# EAGLE design ezrpi (EAGLE 8.0.2)
CNAME: EZRPi sub-GHz Raspberry Pi HAT; CREVISION: 1.0; DESIGNER: Christophe VG
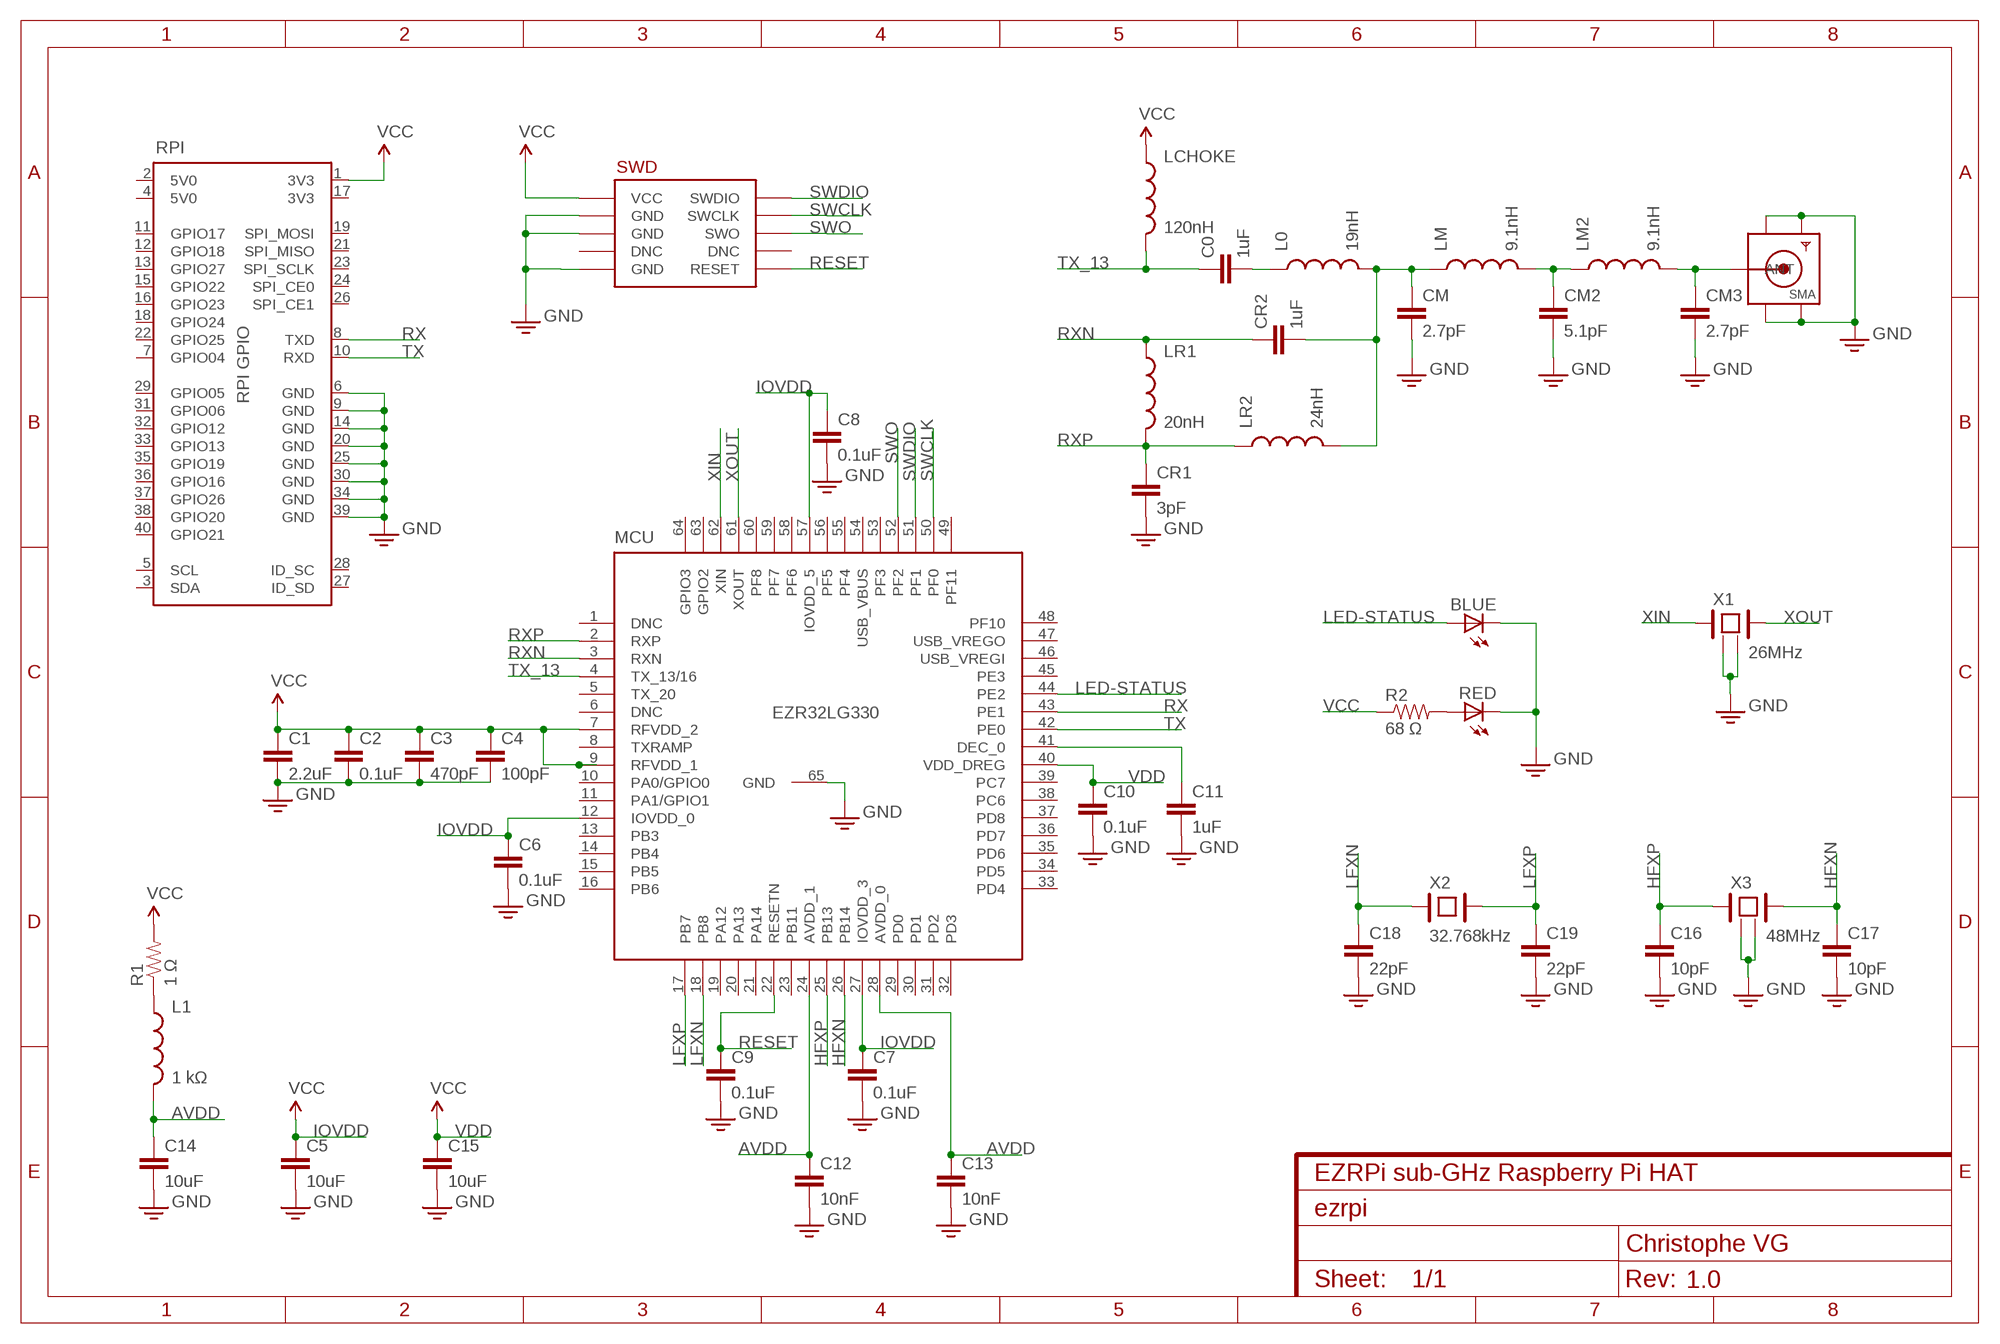
[diagram p0: schematic, sheet 1]

## Parts
BLUE  LEDCHIPLED_0805  [CHIPLED_0805]
C0  1uF  CAP0805  [0805]
C1  2.2uF  CAP0805  [0805]
C2  0.1uF  CAP0805  [0805]
C3  470pF  CAP0805  [0805]
C4  100pF  CAP0805  [0805]
C5  10uF  CAP0805  [0805]
C6  0.1uF  CAP0805  [0805]
C7  0.1uF  CAP0805  [0805]
C8  0.1uF  CAP0805  [0805]
C9  0.1uF  CAP0805  [0805]
C10  0.1uF  CAP0805  [0805]
C11  1uF  CAP0805  [0805]
C12  10nF  CAP0805  [0805]
C13  10nF  CAP0805  [0805]
C14  10uF  CAP0805  [0805]
C15  10uF  CAP0805  [0805]
C16  10pF  CAP0805  [0805]
C17  10pF  CAP0805  [0805]
C18  22pF  CAP0805  [0805]
C19  22pF  CAP0805  [0805]
CM  2.7pF  CAP0805  [0805]
CM2  5.1pF  CAP0805  [0805]
CM3  2.7pF  CAP0805  [0805]
CR1  3pF  CAP0805  [0805]
CR2  1uF  CAP0805  [0805]
L0  19nH  INDUCTOR0402  [C0402]
L1  1 kΩ  INDUCTOR0805  [0805]
LCHOKE  120nH  INDUCTOR0805  [0805]
LM  9.1nH  INDUCTOR0805  [0805]
LM2  9.1nH  INDUCTOR0805  [0805]
LR1  20nH  INDUCTOR0805  [0805]
LR2  24nH  INDUCTOR0805  [0805]
MCU  EZR32LG330  [QFN64G-0.5-9X9MM]
R1  1 Ω  RESISTOR0805-RES  [0805]
R2  68 Ω  RESISTOR0805-RES  [0805]
RED  LEDCHIPLED_0805  [CHIPLED_0805]
RPI  RPI3_HAT  [RASPI_BOARD_B+HAT_DF_CF]
SMA  SMACONNECTOR  [SMA90_DIP]
SWD  FTSH2X5  [HEADER2X5]
X1  26MHz  ABM8  [ABM8]
X2  32.768kHz  MS3V-T1R  [MS3V-T1R]
X3  48MHz  ABM11  [ABM11]

## Nets
AVDD: C12.1 C13.1 C14.1 L1.2 MCU.24(AVDD_1) MCU.28(AVDD_0)
GND: BLUE.C C1.2 C2.2 C3.2 C4.2 C5.2 C6.2 C7.2 C8.2 C9.2 C10.2 C11.2 C12.2 C13.2 C14.2 C15.2 C16.2 C17.2 C18.2 C19.2 CM2.2 CM3.2 CM.2 CR1.2 MCU.65(GND) RED.C RPI.6(GND) RPI.9(GND) RPI.14(GND) RPI.20(GND) RPI.25(GND) RPI.30(GND) RPI.34(GND) RPI.39(GND) SMA.GND1 SMA.GND2 SMA.GND3 SMA.GND4 SWD.P$3(GND) SWD.P$5(GND) SWD.P$9(GND) X1.2(GND) X1.4(GND) X3.2(GND) X3.4(GND)
HFXN: C17.1 MCU.26(PB14) X3.3
HFXP: C16.1 MCU.25(PB13) X3.1
IOVDD: C5.1 C6.1 C7.1 C8.1 MCU.12(IOVDD_0) MCU.27(IOVDD_3) MCU.57(IOVDD_5) ; supply symbol labelled VCC
LED-STATUS: BLUE.A MCU.44(PE2)
LFXN: C18.1 MCU.18(PB8) X2.1
LFXP: C19.1 MCU.17(PB7) X2.2
N$1: CM3.1 LM2.2 SMA.ANTENNA(ANT)
N$2: C11.1 MCU.41(DEC_0)
N$3: CM2.1 LM2.1 LM.2
N$4: L1.1 R1.1
N$6: C0.2 L0.1
N$7: CM.1 CR2.2 L0.2 LM.1 LR2.2
N$8: R2.2 RED.A
RESET: C9.1 MCU.22(RESETN) SWD.P$10(RESET)
RX: MCU.43(PE1) RPI.8(TXD)
RXN: CR2.1 LR1.1 MCU.3(RXN)
RXP: CR1.1 LR1.2 LR2.1 MCU.2(RXP)
SWCLK: MCU.50(PF0) SWD.P$4(SWCLK)
SWDIO: MCU.51(PF1) SWD.P$2(SWDIO)
SWO: MCU.52(PF2) SWD.P$6(SWO)
TX: MCU.42(PE0) RPI.10(RXD)
TX_13: C0.1 LCHOKE.2 MCU.4(TX_13/16)
VCC: C1.1 C2.1 C3.1 C4.1 LCHOKE.1 MCU.7(RFVDD_2) MCU.9(RFVDD_1) R1.2 R2.1 RPI.1(3V3) SWD.P$1(VCC)
VDD: C10.1 C15.1 MCU.40(VDD_DREG) ; supply symbol labelled VCC
XIN: MCU.62(XIN) X1.1
XOUT: MCU.61(XOUT) X1.3
Unconnected: MCU.1(DNC) MCU.5(TX_20) MCU.6(DNC) MCU.8(TXRAMP) MCU.10(PA0/GPIO0) MCU.11(PA1/GPIO1) MCU.13(PB3) MCU.14(PB4) MCU.15(PB5) MCU.16(PB6) MCU.19(PA12) MCU.20(PA13) MCU.21(PA14) MCU.23(PB11) MCU.29(PD0) MCU.30(PD1) MCU.31(PD2) MCU.32(PD3) MCU.33(PD4) MCU.34(PD5) MCU.35(PD6) MCU.36(PD7) MCU.37(PD8) MCU.38(PC6) MCU.39(PC7) MCU.45(PE3) MCU.46(USB_VREGI) MCU.47(USB_VREGO) MCU.48(PF10) MCU.49(PF11) MCU.53(PF3) MCU.54(USB_VBUS) MCU.55(PF4) MCU.56(PF5) MCU.58(PF6) MCU.59(PF7) MCU.60(PF8) MCU.63(GPIO2) MCU.64(GPIO3) RPI.3(SDA) RPI.5(SCL) RPI.7(GPIO04) RPI.11(GPIO17) RPI.12(GPIO18) RPI.13(GPIO27) RPI.15(GPIO22) RPI.16(GPIO23) RPI.18(GPIO24) RPI.19(SPI_MOSI) RPI.21(SPI_MISO) RPI.22(GPIO25) RPI.23(SPI_SCLK) RPI.24(SPI_CE0) RPI.26(SPI_CE1) RPI.27(ID_SD) RPI.28(ID_SC) RPI.29(GPIO05) RPI.31(GPIO06) RPI.32(GPIO12) RPI.33(GPIO13) RPI.35(GPIO19) RPI.36(GPIO16) RPI.37(GPIO26) RPI.38(GPIO20) RPI.40(GPIO21) SWD.P$7(DNC) SWD.P$8(DNC)

## Power pins joined to a net without a drawn wire
3V3: RPI.17(3V3)
5V0: RPI.2(5V0) RPI.4(5V0)

## Library data of the parts
BLUE RED = led:LED: LED OSRAM: - CHIPLED LG R971, LG N971, LY N971, LG Q971, LY Q971, LO R971, LY R971 LH N974, LH R974 LS Q976, LO Q976, LY Q976 LO Q996 - Hyper CHIPLED LW Q18S LB Q993, LB Q99A, LB R99A - SideLED LS A670, LO A670, LY A670, LG A670, LP A670 LB A673, LV A673, LT A673, LW A673 LH A674 LY A675 LS A676, LA A676, LO A676, LY A676, LW A676 LS A679, LY A679, LG A679 - Hyper Micro SIDELED® LS Y876, LA Y876, LO Y876, LY Y876 LT Y87S - SmartLED LW L88C, LW L88S LB L89C, LB L89S, LG L890 LS L89K, LO L89K, LY L89K LS L896, LA L896, LO L896, LY L896 - TOPLED LS T670, LO T670, LY T670, LG T670, LP T670 LSG T670, LSP T670, LSY T670, LOP T670, LYG T670 LG T671, LOG T671, LSG T671 LB T673, LV T673, LT T673, LW T673 LH T674 LS T676, LA T676, LO T676, LY T676, LB T676, LH T676, LSB T676, LW T676 LB T67C, LV T67C, LT T67C, LS T67K, LO T67K, LY T67K, LW E67C LS E67B, LA E67B, LO E67B, LY E67B, LB E67C, LV E67C, LT E67C LW T67C LS T679, LY T679, LG T679 LS T770, LO T770, LY T770, LG T770, LP T770 LB T773, LV T773, LT T773, LW T773 LH T774 LS E675, LA E675, LY E675, LS T675 LS T776, LA T776, LO T776, LY T776, LB T776 LHGB T686 LT T68C, LB T68C - Hyper Mini TOPLED® LB M676 - Mini TOPLED Santana® LG M470 LS M47K, LO M47K, LY M47K Source: http://www.osram.convergy.de LUXEON: - LUMILED® LXK2-PW12-R00, LXK2-PW12-S00, LXK2-PW14-U00, LXK2-PW14-V00 LXK2-PM12-R00, LXK2-PM12-S00, LXK2-PM14-U00 LXK2-PE12-Q00, LXK2-PE12-R00, LXK2-PE12-S00, LXK2-PE14-T00, LXK2-PE14-U00 LXK2-PB12-K00, LXK2-PB12-L00, LXK2-PB12-M00, LXK2-PB14-N00, LXK2-PB14-P00, LXK2-PB14-Q00 LXK2-PR12-L00, LXK2-PR12-M00, LXK2-PR14-Q00, LXK2-PR14-R00 LXK2-PD12-Q00, LXK2-PD12-R00, LXK2-PD12-S00 LXK2-PH12-R00, LXK2-PH12-S00 LXK2-PL12-P00, LXK2-PL12-Q00, LXK2-PL12-R00 Source: www.luxeon.com KINGBRIGHT: KA-3528ASYC Source: www.kingbright.com
C0 C1-C19 CM CM2 CM3 CR1 CR2 = passive:CAP: Capacitor Standard 0603 ceramic capacitor, and 0.1" leaded capacitor.
L0 L1 LCHOKE LM LM2 LR1 LR2 = passive:INDUCTOR: Inductors Basic Inductor/Choke - 0603 and 1206. Footprints are not proven and vary greatly between part numbers. INDUCTOR POWER 3.3UH 4.0A SMD 0.197" L x 0.197" W x 0.177" H (5.00mm x 5.00mm x 4.50mm)
MCU = ezr:EZR32LG330
R1 R2 = passive:RESISTOR: Resistor Basic schematic elements and footprints for 0603, 1206, and PTH resistors.
RPI = rpi:RPI3_HAT
SMA = connector:SMACONNECTOR: SMA Connector 90° DIP SMA Connector, 50 Ohm (4UConnector: 07259)
SWD = connector:FTSH2X5
X1 = xtal:ABM8
X2 = xtal:MS3V-T1R
X3 = xtal:ABM11

## Board
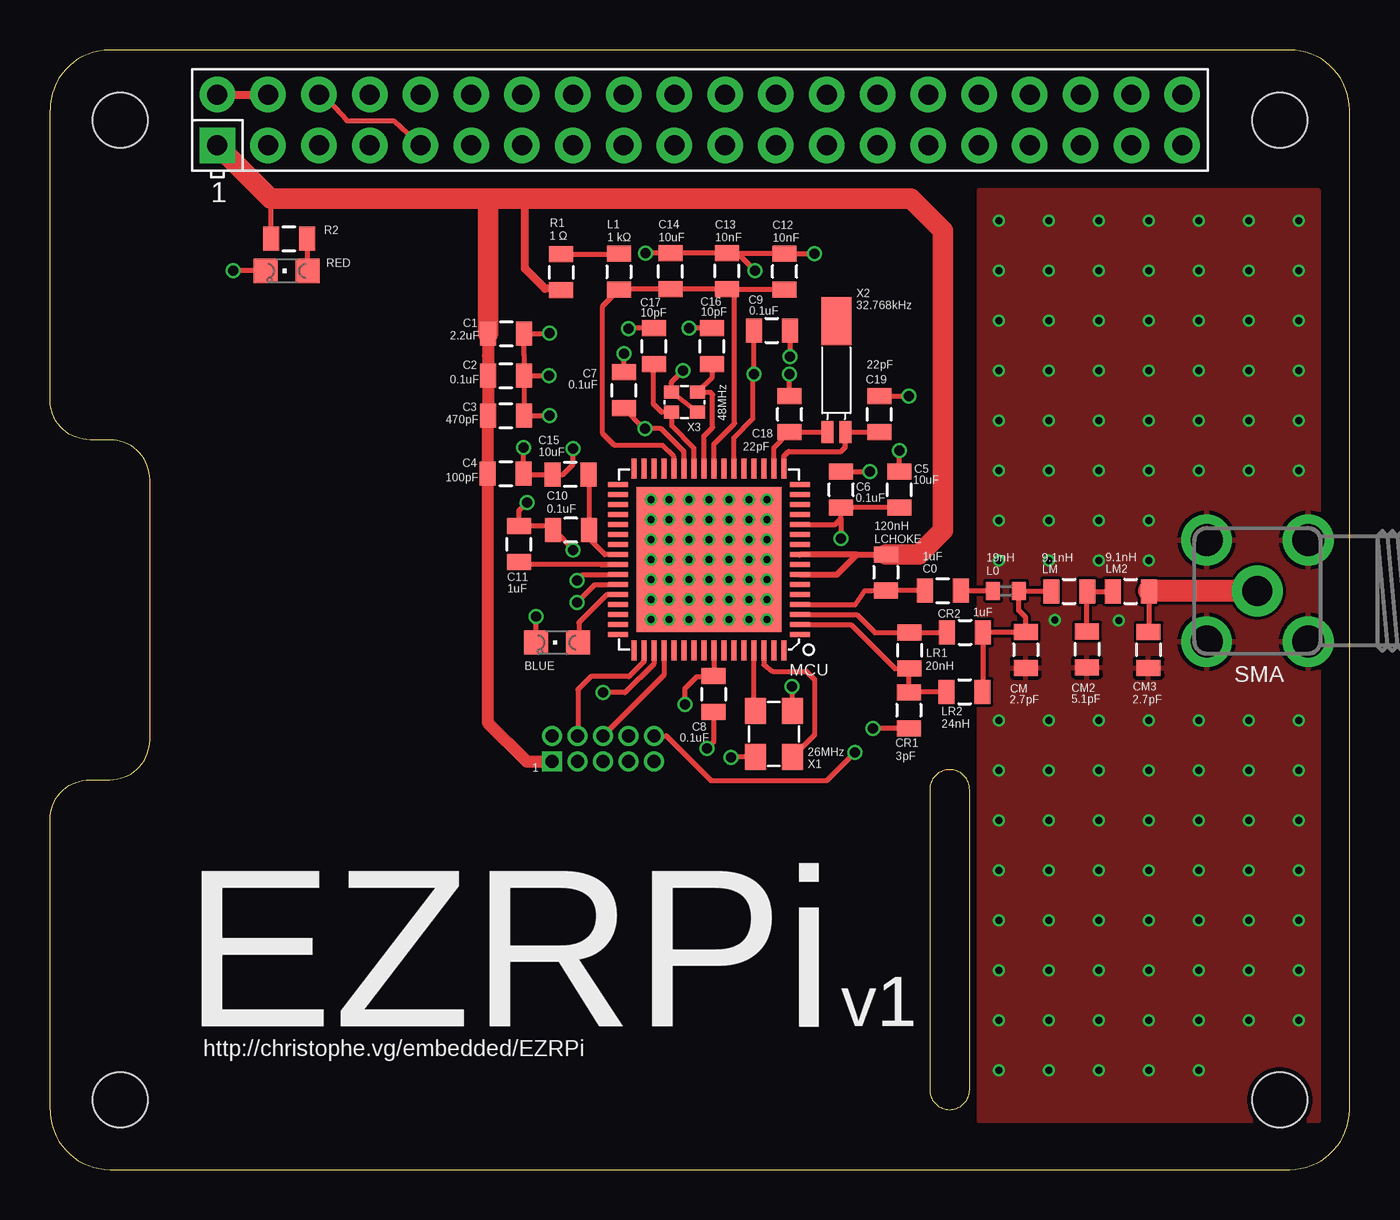
[diagram p1: board, top side]
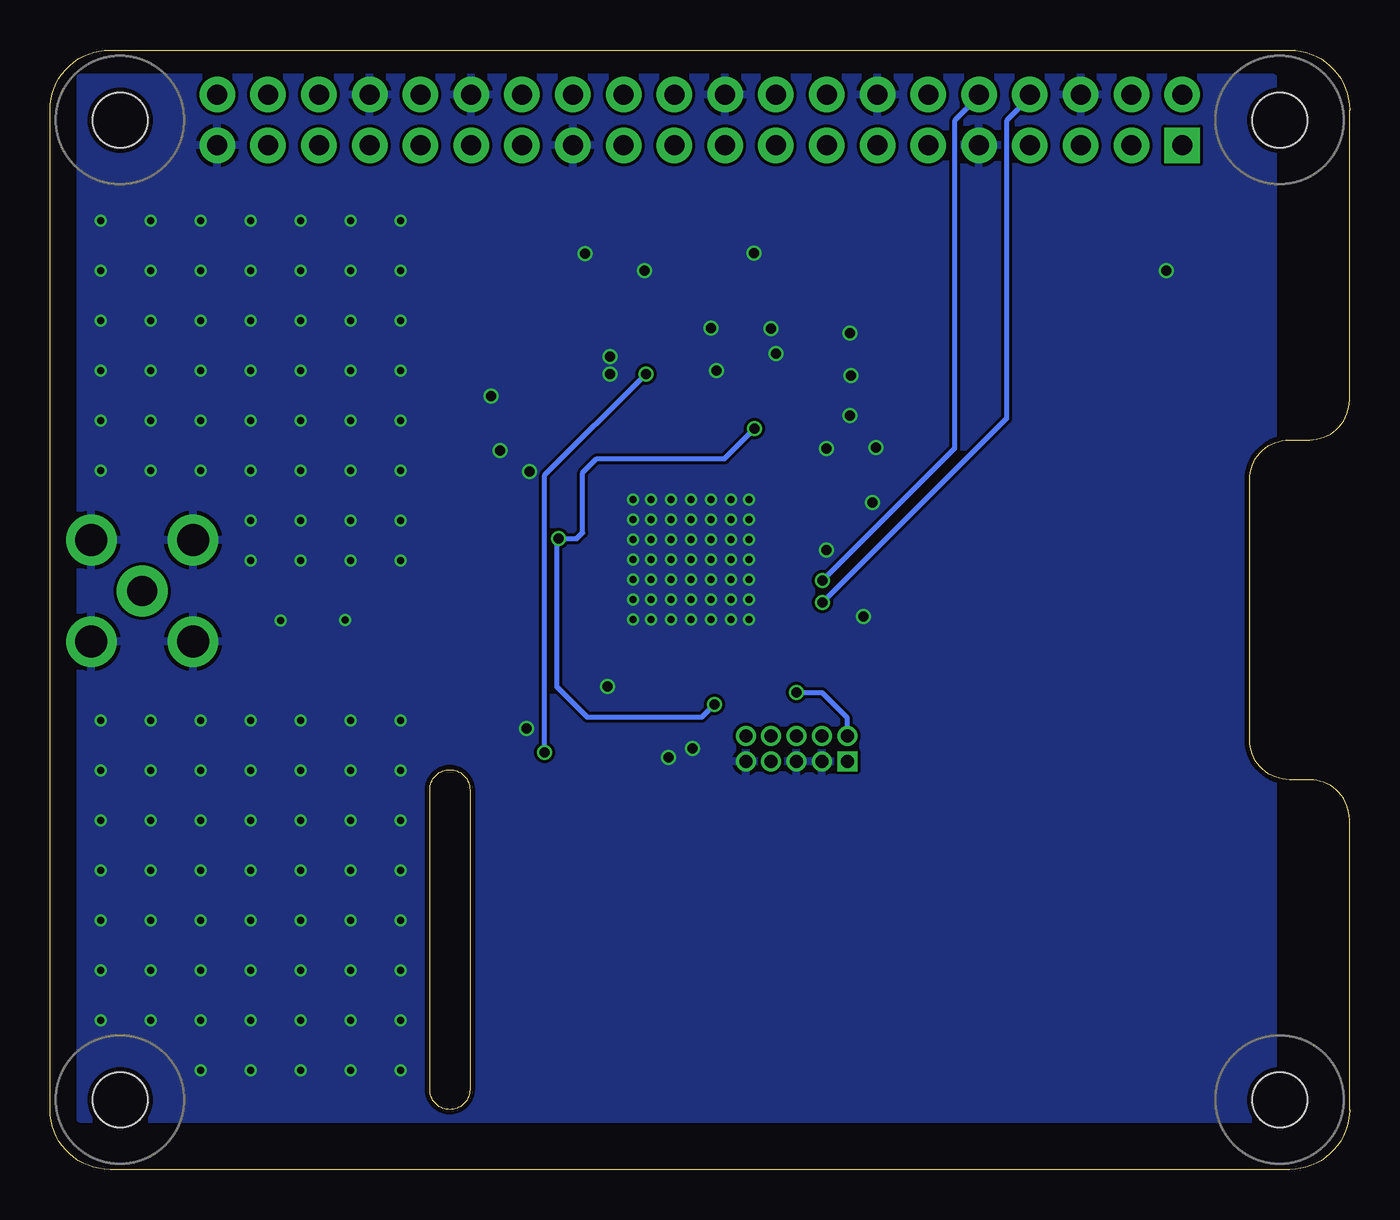
[diagram p2: board, bottom side, seen from below]

Size 65 x 56 mm. Coordinates in mm from the lower left corner, seen from the top.
Copper layers (1*16): Top 0.018mm / dielectric 1.55mm / Bottom 0.018mm
Design rules "eC_2Layer_PClass6_BaseCopperO18_eCDefault *": minimum track width 0.15mm, minimum drill 0.35mm, track to track 0.15mm, track to pad 0.15mm, pad to pad 0.15mm, via to via 0.15mm, smd to smd 0mil, copper to edge 0.25mm, drill to drill 0.35mm, minimum pad ring 0.175mm, minimum via ring 0.125mm, stop-mask expansion 0mil, vias tented up to drill 0.45mm, thermal gap 0.2mm

### Footprints (pad centres in the part's own frame; a part is rotated, then mirrored left to right if it is on the bottom)
CHIPLED_0805 = smd 1.2 x 1.2: A 0,-1.05; C 0,1.05
0805 = smd 0.8 x 1.2: 1 -0.9,0; 2 0.9,0
C0402 = smd 0.7 x 0.9: 1 -0.65,0; 2 0.65,0
QFN64G-0.5-9X9MM = smd 1 x 0.25: 1 -4.55,3.75; 2 -4.55,3.25; 3 -4.55,2.75; 4 -4.55,2.25; 5 -4.55,1.75; 6 -4.55,1.25; 7 -4.55,0.75; 8 -4.55,0.25; 9 -4.55,-0.25; 10 -4.55,-0.75; 11 -4.55,-1.25; 12 -4.55,-1.75; 13 -4.55,-2.25; 14 -4.55,-2.75; 15 -4.55,-3.25; 16 -4.55,-3.75; 33 4.55,-3.75; 34 4.55,-3.25; 35 4.55,-2.75; 36 4.55,-2.25; 37 4.55,-1.75; 38 4.55,-1.25; 39 4.55,-0.75; 40 4.55,-0.25; 41 4.55,0.25; 42 4.55,0.75; 43 4.55,1.25; 44 4.55,1.75; 45 4.55,2.25; 46 4.55,2.75; 47 4.55,3.25; 48 4.55,3.75 | smd 0.25 x 1: 17 -3.75,-4.55; 18 -3.25,-4.55; 19 -2.75,-4.55; 20 -2.25,-4.55; 21 -1.75,-4.55; 22 -1.25,-4.55; 23 -0.75,-4.55; 24 -0.25,-4.55; 25 0.25,-4.55; 26 0.75,-4.55; 27 1.25,-4.55; 28 1.75,-4.55; 29 2.25,-4.55; 30 2.75,-4.55; 31 3.25,-4.55; 32 3.75,-4.55; 49 3.75,4.55; 50 3.25,4.55; 51 2.75,4.55; 52 2.25,4.55; 53 1.75,4.55; 54 1.25,4.55; 55 0.75,4.55; 56 0.25,4.55; 57 -0.25,4.55; 58 -0.75,4.55; 59 -1.25,4.55; 60 -1.75,4.55; 61 -2.25,4.55; 62 -2.75,4.55; 63 -3.25,4.55; 64 -3.75,4.55 | smd 7.25 x 7.25: 65 0,0
RASPI_BOARD_B+HAT_DF_CF = drill 1 pad 1.778 square: 1 8.37,51.23 | drill 1 pad 1.778: 2 8.37,53.77; 3 10.91,51.23; 4 10.91,53.77; 5 13.45,51.23; 6 13.45,53.77; 7 15.99,51.23; 8 15.99,53.77; 9 18.53,51.23; 10 18.53,53.77; 11 21.07,51.23; 12 21.07,53.77; 13 23.61,51.23; 14 23.61,53.77; 15 26.15,51.23; 16 26.15,53.77; 17 28.69,51.23; 18 28.69,53.77; 19 31.23,51.23; 20 31.23,53.77; 21 33.77,51.23; 22 33.77,53.77; 23 36.31,51.23; 24 36.31,53.77; 25 38.85,51.23; 26 38.85,53.77; 27 41.39,51.23; 28 41.39,53.77; 29 43.93,51.23; 30 43.93,53.77; 31 46.47,51.23; 32 46.47,53.77; 33 49.01,51.23; 34 49.01,53.77; 35 51.55,51.23; 36 51.55,53.77; 37 54.09,51.23; 38 54.09,53.77; 39 56.63,51.23; 40 56.63,53.77 | hole 2.75: 3.5,3.5; 3.5,52.5; 61.5,3.5; 61.5,52.5
SMA90_DIP = drill 1.5 pad 2.54: ANTENNA 0,0 | drill 1.6 pad 2.54: GND1 -2.54,2.54; GND2 2.54,2.54; GND3 -2.54,-2.54; GND4 2.54,-2.54
HEADER2X5 = drill 0.65 square: P$1 -2.54,-0.635 | drill 0.65: P$2 -2.54,0.635; P$3 -1.27,-0.635; P$4 -1.27,0.635; P$5 0,-0.635; P$6 0,0.635; P$7 1.27,-0.635; P$8 1.27,0.635; P$9 2.54,-0.635; P$10 2.54,0.635
ABM8 = smd 1.3 x 1.05: 1 1.15,0.925; 2 1.15,-0.925; 3 -1.15,-0.925; 4 -1.15,0.925
MS3V-T1R = smd 2.4 x 1.5: 0 -3.1,0 | smd 1.1 x 0.6: 1 2.45,-0.45; 2 2.45,0.45
ABM11 = smd 0.75 x 0.65: 1 -0.65,-0.5; 2 0.65,-0.5; 3 0.65,0.5; 4 -0.65,0.5

### Placement (x,y rotation side)
BLUE  25.36,26.36 90 top
C0  44.66,28.96 0 top
C1  22.82,41.81 0 top
C2  22.81,39.71 0 top
C3  22.8,37.71 0 top
C4  22.79,34.81 0 top
C5  42.48,34.01 90 top
C6  39.57,34.01 90 top
C7  28.7,38.98 90 top
C8  33.19,23.78 270 top
C9  36.1,41.97 0 top
C10  26.06,31.98 180 top
C11  23.46,31.28 90 top
C12  36.74,44.92 90 top
C13  33.86,44.94 90 top
C14  31.03,44.93 90 top
C15  26.03,34.77 180 top
C16  33.11,41.18 90 top
C17  30.2,41.18 90 top
C18  36.99,37.78 90 top
C19  41.48,37.78 90 top
CM  48.8,25.99 270 top
CM2  51.87,26.02 270 top
CM3  54.94,25.99 270 top
CR1  42.96,22.97 270 top
CR2  45.77,26.87 0 top
L0  47.82,28.94 0 top
L1  28.46,44.91 270 top
LCHOKE  41.8,29.87 270 top
LM  50.98,28.92 0 top
LM2  54.05,28.92 0 top
LR1  42.99,25.97 270 top
LR2  45.74,23.89 0 top
MCU  32.95,30.51 180 top
R1  25.57,44.88 270 top
R2  11.96,46.56 0 top
RED  11.84,44.95 90 top
RPI  0,0 0 top
SMA  60.39,28.94 270 top
SWD  27.66,21.06 0 top
X1  36.2,21.78 270 top
X2  39.33,39.33 270 top
X3  31.74,38.38 180 top

### Tracks (layer width: path | path; a pad name or v marks a point on that pad's centre or on a via)
5V0
  Top 0.406: RPI.2 RPI.4
AVDD
  Top 0.254: MCU.24 33.2,36.28 34.24,37.32 34.24,43.66 C13.1 | C12.1 33.88,44.02 C13.1 | C13.1 C14.1 28.48,44.03 L1.2 | 28.44,43.99 L1.2 | MCU.28 31.2,35.66 30.64,36.22 28.24,36.22 27.64,36.82 27.64,43.19 L1.2
GND  (via drill 0.35, 0.35 pad 0.35, 0.5, 0.5 pad 0.25)
  Top 0.254: 35.27,21.08 X1.2 34.08,20.63 v34.06,20.61 | CR1.2 v41.16,22.06 | C13.2 C14.2 v29.79,45.83 | C13.2 36.72,45.84 C12.2 v38.24,45.82 | 30.16,42.12 C17.2 | 30.18,42.06 C17.2 | 23.77,34.73 C4.2 | C3.2 | C2.2 23.72,40.72 C1.2 24.5,41.81 v24.98,41.83 | C2.2 C3.2 | C3.2 v24.99,37.71 | 51.9,25.09 CM2.2 | 48.83,25.12 CM.2 | C4.2 23.73,34.77 C15.2 25.67,34.77 26.16,35.26 26.16,35.86 v26.16,36.06 | X3.4 X3.2 31.09,39.39 v31.66,39.96 | RPI.6 13.65,53.77 14.86,52.46 17.2,52.46 RPI.9 | RED.C v9.17,44.95 v9.16,44.96 | BLUE.C v24.31,27.66 | C18.2 36.99,39.73 v36.99,39.79 | C9.2 37,40.8 v37,40.66 | C7.2 v28.7,40.82 | C17.2 v28.95,42.08 v28.94,42.07 | C16.2 v31.95,42.08 | C2.2 v24.95,39.71 | C13.2 34.38,45.84 v35.26,44.96 | C19.2 v42.95,38.68 | C5.2 42.48,35.84 v42.48,35.95 | C6.2 v41.02,34.91 | C4.2 v23.69,36.12 | v23.86,33.36 23.46,32.96 C11.2 24.96,32.18 C10.2 25.24,31.98 v26.16,31 | C8.2 33.19,21.39 v32.86,21.06 | X1.4 v37.12,24.16 v37.12,24.17
  other vias: 32.95,32.52 32.95,28.52 34.95,32.52 34.95,30.52 34.95,28.52 30.95,28.52 30.95,30.52 30.95,32.52 32.95,30.51 49.96,47.46 54.96,47.46 59.96,47.46 59.96,42.46 54.96,42.46 49.96,42.46 49.96,37.46 54.96,37.46 59.96,37.46 54.96,32.46 49.96,32.46 49.96,22.46 54.96,22.46 59.96,22.46 59.96,17.46 59.96,12.46 59.96,7.46 54.96,7.46 49.96,7.46 49.96,12.46 54.96,12.46 54.96,17.46 49.96,17.46 30.95,33.52 30.05,33.52 30.05,32.52 31.95,32.52 31.95,33.52 32.95,33.52 33.95,33.52 33.95,32.52 34.95,33.52 35.85,33.52 30.05,31.52 30.05,30.52 30.95,31.52 31.95,30.51 33.95,30.52 33.95,31.52 32.95,31.52 31.95,31.52 34.95,31.52 35.85,31.52 35.85,30.52 30.05,29.52 30.05,28.52 30.05,27.52 30.95,29.52 32.95,29.52 33.95,29.52 34.95,29.52 35.85,29.52 33.95,28.52 35.85,28.52 35.85,27.52 34.95,27.52 33.95,27.52 32.95,27.52 31.95,27.52 30.95,27.52 31.95,28.52 31.95,29.52 35.85,32.52 52.46,47.46 52.46,44.96 49.96,44.96 52.46,42.46 52.46,39.96 52.46,37.46 52.46,34.96 52.46,32.46 49.96,34.96 49.96,39.96 54.96,44.96 54.96,39.96 54.96,34.96 57.46,34.96 57.46,37.46 57.46,39.96 57.46,42.46 57.46,44.96 57.46,47.46 59.96,44.96 59.96,39.96 62.46,39.96 62.46,42.46 62.46,44.96 62.46,47.46 62.46,37.46 62.46,34.96 59.96,34.96 49.96,19.96 49.96,14.96 49.96,9.96 49.96,4.96 52.46,4.96 52.46,7.46 52.46,9.96 52.46,12.46 52.46,14.96 52.46,17.46 52.46,19.96 52.46,22.46 57.46,22.46 57.46,19.96 54.96,19.96 57.46,17.46 54.96,14.96 57.46,14.96 57.46,12.46 59.96,14.96 59.96,19.96 62.46,19.96 62.46,22.46 62.46,17.46 62.46,14.96 62.46,12.46 54.96,9.96 54.96,4.96 57.46,4.96 57.46,7.46 57.46,9.96 59.96,9.96 62.46,9.96 62.46,7.46 47.46,47.46 47.46,44.96 47.46,42.46 47.46,39.96 47.46,37.46 47.46,34.96 47.46,32.46 47.46,22.46 47.46,19.96 47.46,17.46 47.46,14.96 47.46,12.46 47.46,9.96 47.46,7.46 47.46,4.96 54.96,30.46 52.46,30.46 49.96,30.46 47.46,30.46 50.25,27.48 53.46,27.46
  pour Bottom: 3.81,54.61 63.5,54.61 63.5,2.54 3.81,2.54
  pour Top: 63.46,48.96 46.46,48.96 46.46,2.46 63.46,2.46
HFXN
  Top 0.254: 30.34,40.14 C17.1 30.19,38.28 30.59,37.88 X3.3 31.1,37.2 32.2,36.1 MCU.26
HFXP
  Top 0.254: MCU.25 32.7,36.68 33.14,37.12 33.14,38.76 33.02,38.88 X3.1 33.11,39.6 C16.1
IOVDD  (via drill 0.5)
  Top 0.254: C5.1 C6.1 39.56,32.56 | 39.56,32.56 39.56,32.26 v39.56,31.56 | v31.76,23.26 31.76,24.06 32.36,24.66 33.17,24.66 C8.1 MCU.57 | MCU.12 39.26,32.26 39.56,32.56 | C7.1 29.72,37.06 v29.76,37.06 30.56,37.06 31.7,35.92 MCU.27
  Bottom 0.254: v31.76,23.26 32.39,22.63 38.13,22.63 39.66,24.16 39.66,31.46 v39.56,31.56 38.66,31.56 38.36,31.86 38.36,34.86 37.66,35.56 31.26,35.56 v29.76,37.06
LED-STATUS
  Top 0.254: MCU.44 27.86,28.76 26.46,27.36 26.46,26.41 BLUE.A
LFXN
  Top 0.254: X2.1 C18.1 36.2,36.09 MCU.18
LFXP
  Top 0.254: C19.1 X2.2 39.78,36.13 39.57,35.92 36.94,35.92 36.7,35.68 MCU.17
N$1
  Top 0.254: 54.97,28.94 LM2.2 54.95,26.91 CM3.1
  Top 1.1: SMA.ANTENNA 54.97,28.94
N$2
  Top 0.254: 27.56,30.26 MCU.41 23.58,30.26 C11.1 23.48,30.36
N$3
  Top 0.254: LM2.1 LM.2 CM2.1
N$4
  Top 0.254: R1.1 28.43,45.78 L1.1
N$6
  Top 0.254: C0.2 47.15,28.96 L0.1
N$7
  Top 0.254: LM.1 50.06,28.94 L0.2 48.46,27.96 48.8,27.62 CM.1 48.78,26.87 CR2.2 46.67,23.92 LR2.2
N$8
  Top 0.254: R2.2 12.86,44.98 RED.A
RESET  (via drill 0.5)
  Top 0.254: v40.26,20.86 38.86,19.46 33.06,19.46 30.83,21.7 SWD.P$10 | C9.1 v35.2,39.79 35.16,39.75 35.16,37.56 34.2,36.6 MCU.22
  Bottom 0.254: v40.26,20.86 40.26,34.73 v35.2,39.79
RX  (via drill 0.5)
  Top 0.254: v26.36,28.36 27.26,29.26 MCU.43
  Bottom 0.254: RPI.8 15.99,53.63 17.16,52.46 17.16,37.56 v26.36,28.36
RXN
  Top 0.254: LR1.1 CR2.1 | LR1.1 | MCU.3 40.36,27.76 41.26,26.86 LR1.1 | LR1.1
RXP
  Top 0.254: LR2.1 42.98,23.89 CR1.1 42.96,25.04 LR1.2 | 42.9,25.16 LR1.2 | MCU.2 40.06,27.26 42.26,25.06 LR1.2
SWCLK
  Top 0.254: MCU.50 29.7,25.4 28.96,24.66 27.05,24.66 26.4,24.01 SWD.P$4
SWDIO  (via drill 0.5)
  Top 0.254: MCU.51 30.2,25.3 28.76,23.86 v27.66,23.86
  Bottom 0.254: v27.66,23.86 26.38,23.86 25.14,22.62 25.14,21.71 SWD.P$2
SWO
  Top 0.254: MCU.52 30.7,24.73 SWD.P$6
TX  (via drill 0.5)
  Top 0.254: v26.36,29.46 26.66,29.76 MCU.42
  Bottom 0.254: RPI.10 18.53,53.69 19.76,52.46 19.76,36.06 v26.36,29.46
TX_13
  Top 0.254: C0.1 LCHOKE.2 40.76,28.96 40.28,28.26 MCU.4
VCC
  Top 0.254: 21.91,43.51 C1.1 21.96,43.55 | C2.1 21.9,40.71 | C3.1 | LCHOKE.1 | 22.16,48.56 21.92,48.56 | R1.2 25.49,44.06 | LCHOKE.1 | R2.1 11.06,48.54 11.04,48.56
  Top 0.305: 40.36,30.76 MCU.9 | 40.36,30.76 LCHOKE.1 | MCU.7 39.36,29.76 40.36,30.76
  Top 0.406: 25.49,44.06 24.76,44.06 23.76,45.06 23.76,48.56
  Top 0.61: 21.91,43.51 C2.1 | 21.9,40.71 C3.1 | C3.1 C4.1 21.89,22.36 23.85,20.4 25.1,20.4 SWD.P$1
  Top 1.016: RPI.1 11.04,48.56 21.26,48.56 22.16,48.56 | 22.16,48.56 23.76,48.56 43.06,48.56 44.66,46.96 44.66,31.96 43.46,30.76 LCHOKE.1 | C1.1 21.92,48.32 22.16,48.56
VDD
  Top 0.254: C15.1 26.96,34.74 C10.1 26.96,31.56 27.76,30.76 MCU.40
XIN
  Top 0.254: MCU.62 35.7,25.26 36.14,24.92 37.84,24.92 38.24,24.52 38.24,21.75 X1.1
XOUT
  Top 0.254: X1.3 35.2,22.93 MCU.61

### Text on the board
tNames: EZRPi | v1 | http://christophe.vg/embedded/EZRPi